# EAGLE design pov (EAGLE 6.1)
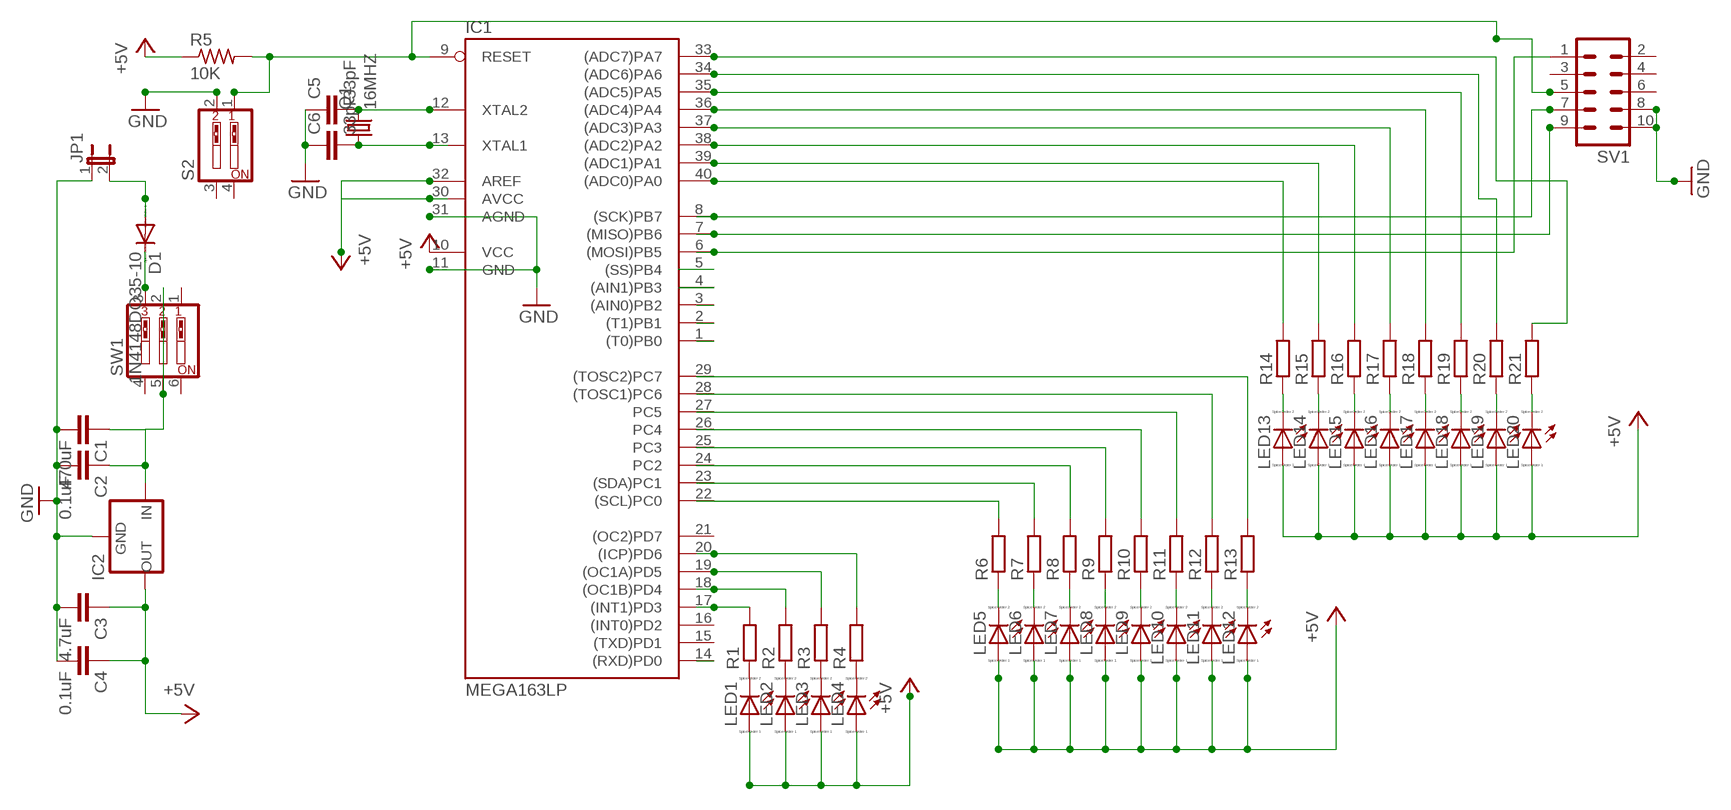
[diagram p0: schematic, sheet 1]

## Parts
C1  470uF  C2.5/4  [C2.5-4]
C2  0.1uF  C2.5/4  [C2.5-4]
C3  4.7uF  C2.5/4  [C2.5-4]
C4  0.1uF  C2.5/4  [C2.5-4]
C5  33pF  C2.5/4  [C2.5-4]
C6  33pF  C2.5/4  [C2.5-4]
D1  1N4148DO35-10  [DO35-10]
IC1  MEGA163LP  [DIL40]
IC2  78XXS  [78XXS]
JP1  JP1E  [JP1]
LED1  LED_ELD260  [LED_LD260]
LED2  LED_ELD260  [LED_LD260]
LED3  LED_ELD260  [LED_LD260]
LED4  LED_ELD260  [LED_LD260]
LED5  LED_ELD260  [LED_LD260]
LED6  LED_ELD260  [LED_LD260]
LED7  LED_ELD260  [LED_LD260]
LED8  LED_ELD260  [LED_LD260]
LED9  LED_ELD260  [LED_LD260]
LED10  LED_ELD260  [LED_LD260]
LED11  LED_ELD260  [LED_LD260]
LED12  LED_ELD260  [LED_LD260]
LED13  LED_ELD260  [LED_LD260]
LED14  LED_ELD260  [LED_LD260]
LED15  LED_ELD260  [LED_LD260]
LED16  LED_ELD260  [LED_LD260]
LED17  LED_ELD260  [LED_LD260]
LED18  LED_ELD260  [LED_LD260]
LED19  LED_ELD260  [LED_LD260]
LED20  LED_ELD260  [LED_LD260]
Q1  16MHZ  CRYSTALHC49U-V  [HC49U-V]
R1  R-EU_0207/7  [0207/7]
R2  R-EU_0207/7  [0207/7]
R3  R-EU_0207/7  [0207/7]
R4  R-EU_0207/7  [0207/7]
R5  10K  R-US_0204/7  [0204/7]
R6  R-EU_0207/7  [0207/7]
R7  R-EU_0207/7  [0207/7]
R8  R-EU_0207/7  [0207/7]
R9  R-EU_0207/7  [0207/7]
R10  R-EU_0207/7  [0207/7]
R11  R-EU_0207/7  [0207/7]
R12  R-EU_0207/7  [0207/7]
R13  R-EU_0207/7  [0207/7]
R14  R-EU_0207/7  [0207/7]
R15  R-EU_0207/7  [0207/7]
R16  R-EU_0207/7  [0207/7]
R17  R-EU_0207/7  [0207/7]
R18  R-EU_0207/7  [0207/7]
R19  R-EU_0207/7  [0207/7]
R20  R-EU_0207/7  [0207/7]
R21  R-EU_0207/7  [0207/7]
S2  SW_DIP-2  [EDG-02]
SV1  MA05-2  [MA05-2]
SW1  SW_DIP-3  [EDG-03]

## Nets
+5V: C3.1 C4.1 IC1.10(VCC) IC1.30(AVCC) IC1.32(AREF) IC2.OUT LED1.A LED2.A LED3.A LED4.A LED5.A LED6.A LED7.A LED8.A LED9.A LED10.A LED11.A LED12.A LED13.A LED14.A LED15.A LED16.A LED17.A LED18.A LED19.A LED20.A R5.1
GND: C1.2 C2.2 C3.2 C4.2 C5.1 C6.1 IC1.11(GND) IC1.31(AGND) IC2.GND JP1.1 S2.2 SV1.8 SV1.10
N$1: D1.A JP1.2
N$2: LED12.K(C) R13.1
N$3: C5.2 IC1.12(XTAL2) Q1.2
N$4: C6.2 IC1.13(XTAL1) Q1.1
N$5: LED1.K(C) R1.1
N$6: IC1.9(RESET) R5.2 S2.1 SV1.5
N$7: IC1.22((SCL)PC0) R6.2
N$8: D1.C SW1.3
N$9: C1.1 C2.1 IC2.IN SW1.2 SW1.5
N$10: IC1.1((T0)PB0)
N$11: IC1.2((T1)PB1)
N$12: IC1.3((AIN0)PB2)
N$13: IC1.4((AIN1)PB3)
N$14: IC1.17((INT1)PD3) R1.2
N$15: IC1.19((OC1A)PD5) R3.2
N$16: IC1.5((SS)PB4)
N$17: IC1.28((TOSC1)PC6) R12.2
N$18: LED10.K(C) R11.1
N$19: IC1.26(PC4) R10.2
N$20: LED9.K(C) R10.1
N$21: IC1.25(PC3) R9.2
N$22: LED8.K(C) R9.1
N$23: LED7.K(C) R8.1
N$24: IC1.6((MOSI)PB5) SV1.1
N$25: IC1.7((MISO)PB6) SV1.9
N$26: IC1.8((SCK)PB7) SV1.7
N$27: IC1.14((RXD)PD0)
N$28: IC1.23((SDA)PC1) R7.2
N$29: IC1.33((ADC7)PA7) R21.2
N$30: IC1.34((ADC6)PA6) R20.2
N$31: IC1.35((ADC5)PA5) R19.2
N$32: IC1.36((ADC4)PA4) R18.2
N$33: IC1.37((ADC3)PA3) R17.2
N$34: IC1.38((ADC2)PA2) R16.2
N$35: IC1.39((ADC1)PA1) R15.2
N$36: IC1.40((ADC0)PA0) R14.2
N$37: IC1.24(PC2) R8.2
N$38: IC1.27(PC5) R11.2
N$39: IC1.29((TOSC2)PC7) R13.2
N$40: LED6.K(C) R7.1
N$41: LED20.K(C) R21.1
N$42: LED19.K(C) R20.1
N$43: LED18.K(C) R19.1
N$44: LED17.K(C) R18.1
N$45: LED15.K(C) R16.1
N$46: LED13.K(C) R14.1
N$47: LED16.K(C) R17.1
N$48: LED14.K(C) R15.1
N$49: LED5.K(C) R6.1
N$50: LED11.K(C) R12.1
N$51: LED2.K(C) R2.1
N$52: LED3.K(C) R3.1
N$53: LED4.K(C) R4.1
N$55: IC1.20((ICP)PD6) R4.2
N$56: IC1.18((OC1B)PD4) R2.2
Unconnected: IC1.15((TXD)PD1) IC1.16((INT0)PD2) IC1.21((OC2)PD7) S2.3 S2.4 SV1.2 SV1.3 SV1.4 SV1.6 SW1.1 SW1.4 SW1.6

## Library data of the parts
C1-C6 = capacitor-wima:C: CAPACITOR naming: grid - package width
D1 = diode:1N4148: DIODE high speed (Philips)
IC1 = atmel:MEGA163*P: MICROCONTROLLER 16 Kbytes FLASH 1 Kbytes EEPROM 1 Kbytes SRAM UART 8-channel 10 bit ADC hardware multiplier Source: avr.lbr; OC_FARNELL: unknown; OC_NEWARK: unknown
IC2 = v-reg:78XXS: VOLTAGE REGULATOR
JP1 = jumper:JP1E: JUMPER
LED1-LED20 = eagle-ltspice:LED_E: LED Source: http://www.osram.convergy.de Source: www.luxeon.com Source: www.kingbright.com; SPICEMODEL: NONE; SPICEPREFIX: D; SPICETYPE: diode
Q1 = crystal:CRYSTAL: CRYSTAL; OC_FARNELL: 1666969; OC_NEWARK: unknown
R1-R4 R6-R21 = rcl:R-EU_: RESISTOR, European symbol
R5 = resistor:R-US_: RESISTOR, American symbol
S2 = special:SW_DIP-2: DIP SWITCH
SV1 = con-lstb:MA05-2: PIN HEADER; OC_FARNELL: unknown; OC_NEWARK: unknown
SW1 = special:SW_DIP-3: DIP SWITCH

## Board
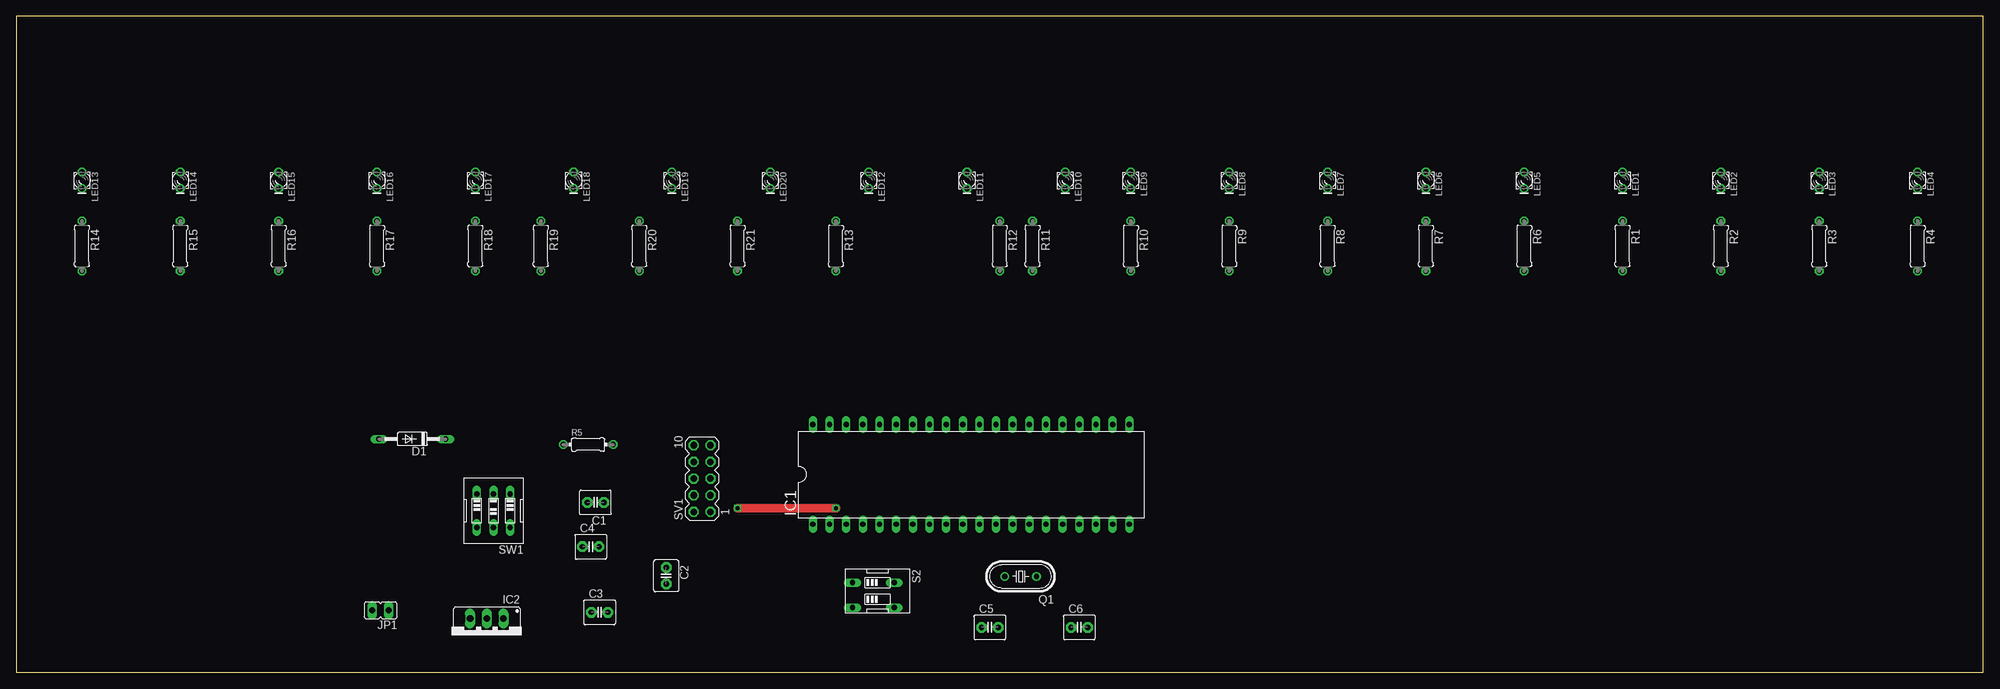
[diagram p1: board, top side]
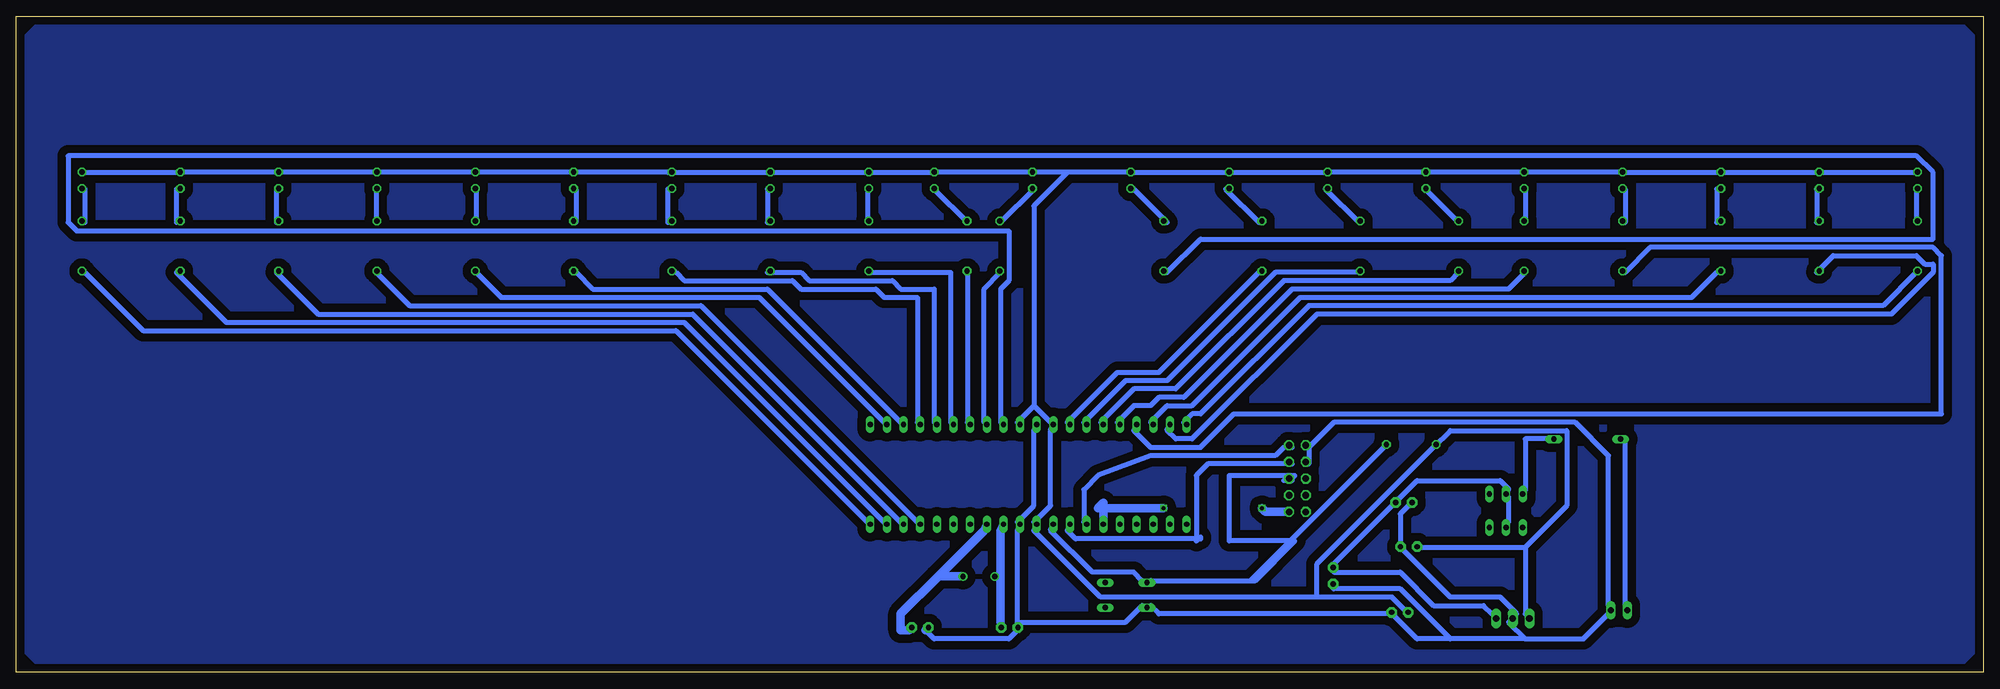
[diagram p2: board, bottom side, seen from below]

Size 300 x 100 mm. Coordinates in mm from the lower left corner, seen from the top.
Outline: 0,0 300,0 300,100 0,100 0,0
Copper layers (1*16): Top 0.035mm / dielectric 1.5mm / Bottom 0.035mm
Design rules: minimum track width 30mil, minimum drill 24mil, track to track 8mil, track to pad 8mil, pad to pad 8mil, via to via 8mil, smd to smd 8mil, copper to edge 40mil, drill to drill 8mil, minimum pad ring 10mil, minimum via ring 8mil, stop-mask expansion 4mil, vias tented up to drill 0mil, thermal gap 10mil

### Footprints (pad centres in the part's own frame; a part is rotated, then mirrored left to right if it is on the bottom)
C2.5-4 = drill 0.813 pad 1.6 octagon: 1 -1.27,0; 2 1.27,0
DO35-10 = drill 0.813 long: A 5.08,0; C -5.08,0
DIL40 = drill 0.813 long: 1 -24.13,-7.62; 2 -21.59,-7.62; 3 -19.05,-7.62; 4 -16.51,-7.62; 5 -13.97,-7.62; 6 -11.43,-7.62; 7 -8.89,-7.62; 8 -6.35,-7.62; 9 -3.81,-7.62; 10 -1.27,-7.62; 11 1.27,-7.62; 12 3.81,-7.62; 13 6.35,-7.62; 14 8.89,-7.62; 15 11.43,-7.62; 16 13.97,-7.62; 17 16.51,-7.62; 18 19.05,-7.62; 19 21.59,-7.62; 20 24.13,-7.62; 21 24.13,7.62; 22 21.59,7.62; 23 19.05,7.62; 24 16.51,7.62; 25 13.97,7.62; 26 11.43,7.62; 27 8.89,7.62; 28 6.35,7.62; 29 3.81,7.62; 30 1.27,7.62; 31 -1.27,7.62; 32 -3.81,7.62; 33 -6.35,7.62; 34 -8.89,7.62; 35 -11.43,7.62; 36 -13.97,7.62; 37 -16.51,7.62; 38 -19.05,7.62; 39 -21.59,7.62; 40 -24.13,7.62
78XXS = drill 1.016 long: GND 0,-2.54; IN -2.54,-2.54; OUT 2.54,-2.54
JP1 = drill 0.914 long: 1 0,-1.27; 2 0,1.27
LED_LD260 = drill 0.813 octagon: A -1.27,0; K 1.27,0
HC49U-V = drill 0.813: 1 -2.413,0; 2 2.413,0
0207/7 = drill 0.813 octagon: 1 -3.81,0; 2 3.81,0
0204/7 = drill 0.813 octagon: 1 -3.81,0; 2 3.81,0
EDG-02 = drill 0.813 long: 1 -1.27,-3.81; 2 2.54,-3.81; 3 2.54,2.54; 4 -1.27,2.54
MA05-2 = drill 1.016 octagon: 1 -5.08,-1.27; 2 -5.08,1.27; 3 -2.54,-1.27; 4 -2.54,1.27; 5 0,-1.27; 6 0,1.27; 7 2.54,-1.27; 8 2.54,1.27; 9 5.08,-1.27; 10 5.08,1.27
EDG-03 = drill 0.813 long: 1 -2.54,-2.54; 2 0,-2.54; 3 2.54,-2.54; 4 2.54,2.54; 5 0,2.54; 6 -2.54,2.54

### Placement (x,y rotation side)
C1  88.34,25.87 180 top
C2  99.13,14.69 270 top
C3  88.96,9.13 0 top
C4  87.61,19.13 0 top
C5  148.49,6.83 0 top
C6  162.14,6.83 0 top
D1  60.4,35.55 180 top
IC1  145.63,30.16 0 top
IC2  71.75,5.63 180 top
JP1  55.55,9.44 90 top
LED1  245,75 270 top
LED2  260,75 270 top
LED3  275,75 270 top
LED4  290,75 270 top
LED5  230,75 270 top
LED6  215,75 270 top
LED7  200,75 270 top
LED8  185,75 270 top
LED9  170,75 270 top
LED10  160,75 270 top
LED11  145,75 270 top
LED12  130,75 270 top
LED13  10,75 270 top
LED14  25,75 270 top
LED15  40,75 270 top
LED16  55,75 270 top
LED17  70,75 270 top
LED18  85,75 270 top
LED19  100,75 270 top
LED20  115,75 270 top
Q1  153.18,14.6 180 top
R1  245,65 270 top
R2  260,65 270 top
R3  275,65 270 top
R4  290,65 270 top
R5  87.22,34.69 0 top
R6  230,65 270 top
R7  215,65 270 top
R8  200,65 270 top
R9  185,65 270 top
R10  170,65 270 top
R11  155,65 270 top
R12  150,65 270 top
R13  125,65 270 top
R14  10,65 270 top
R15  25,65 270 top
R16  40,65 270 top
R17  55,65 270 top
R18  70,65 270 top
R19  80,65 270 top
R20  95,65 270 top
R21  110,65 270 top
S2  131.35,12.39 270 top
SV1  104.6,29.52 90 top
SW1  72.78,24.6 180 top

### Tracks (layer width: path | path; a pad name or v marks a point on that pad's centre or on a via)
+5V
  Bottom 0.762: 69.85,19.05 69.85,8.89 IC2.OUT | 69.85,19.05 86.36,19.05 C4.1 | 144.78,40.64 147.32,38.1 IC1.30 | 144.78,40.64 142.24,38.1 IC1.32 142.24,36.83 142.24,25.4 144.78,22.86 IC1.10 144.78,21.59 134.62,11.43 101.6,11.43 | 83.82,34.29 101.6,16.51 101.6,11.43 | 101.6,11.43 90.17,11.43 87.63,8.89 C3.1 | 69.85,19.05 63.5,25.4 63.5,36.83 81.28,36.83 83.82,34.29 | 83.82,34.29 R5.1 | 25.4,76.2 10.16,76.2 LED13.A | 54.61,76.2 40.64,76.2 LED15.A 39.37,76.2 25.4,76.2 | 54.61,76.2 69.85,76.2 | 54.61,76.2 LED16.A | 69.85,76.2 85.09,76.2 | 69.85,76.2 LED17.A | 85.09,76.2 100.33,76.2 | 85.09,76.2 LED18.A | 25.4,76.2 LED14.A | 170.18,76.2 160.02,76.2 | 129.54,76.2 115.57,76.2 | 129.54,76.2 139.7,76.2 | 139.7,76.2 144.78,76.2 | 129.54,76.2 LED12.A | 144.78,76.2 160.02,76.2 | 160.02,76.2 LED10.A | 144.78,76.2 LED11.A | 275.59,76.2 289.56,76.2 LED4.A | 185.42,76.2 199.39,76.2 LED7.A 200.66,76.2 214.63,76.2 | 214.63,76.2 229.87,76.2 | 214.63,76.2 LED6.A | 229.87,76.2 245.11,76.2 | 229.87,76.2 LED5.A | 245.11,76.2 260.35,76.2 | 245.11,76.2 LED1.A | 260.35,76.2 275.59,76.2 | 275.59,76.2 LED3.A | 260.35,76.2 LED2.A | 185.42,76.2 170.18,76.2 | 170.18,76.2 LED9.A | 185.42,76.2 LED8.A | 115.57,76.2 100.33,76.2 | 100.33,76.2 LED19.A | 115.57,76.2 LED20.A | 144.78,40.64 144.78,71.12 139.7,76.2
GND
  Bottom 0.762: 147.32,7.62 130.81,7.62 128.27,10.16 S2.2 127,10.16 125.73,8.89 90.17,8.89 | 147.32,7.62 147.32,21.59 IC1.11 147.32,22.86 144.78,25.4 144.78,36.83 IC1.31 | 147.32,7.62 C5.1 147.32,6.35 148.59,5.08 160.02,5.08 161.29,6.35 | 88.9,19.05 88.9,24.13 87.63,25.4 C1.2 | 102.87,34.29 102.87,31.75 SV1.8 | 69.85,5.08 60.96,5.08 57.15,8.89 JP1.1 57.15,10.16 57.15,33.02 62.23,38.1 99.06,38.1 102.87,34.29 | 69.85,5.08 72.39,7.62 IC2.GND 71.12,8.89 73.66,11.43 81.28,11.43 88.9,19.05 | 90.17,8.89 86.36,5.08 81.28,5.08 | 69.85,5.08 81.28,5.08 | 81.28,5.08 88.9,12.7 99.06,12.7 C2.2 | 102.87,34.29 SV1.10 | 88.9,19.05 C4.2 | 90.17,8.89 C3.2
  Bottom 1.27: 161.29,6.35 C6.1
N$1
  Bottom 0.762: D1.A 54.61,35.56 54.61,10.16 JP1.2
N$2
  Bottom 0.762: R13.1 124.46,68.58 129.54,73.66 LED12.K
N$3
  Bottom 0.406: 150.26,14.6 149.86,15
  Bottom 0.762: 149.86,7.62 C5.2
  Bottom 1.27: 149.86,7.62 149.86,15 149.86,21.59 IC1.12 | Q1.2 150.26,14.6
N$4
  Bottom 0.406: 159.39,14.6 159.5,14.49
  Bottom 1.27: IC1.13 152.4,21.59 159.5,14.49 165.1,8.89 165.1,6.35 163.83,6.35 C6.2 | Q1.1 159.39,14.6
N$5
  Bottom 0.762: R1.1 245.11,68.58 245.11,73.66 LED1.K
N$6
  Bottom 0.762: 111.76,13.97 91.44,34.29 R5.2 | 111.76,13.97 127,13.97 S2.1 128.27,13.97 129.54,15.24 135.89,15.24 142.24,21.59 IC1.9 | 105.79,29.21 105.41,29.21 SV1.5 | 111.76,13.97 111.03,13.97 105,20 115,20 115,30 105,30 105.79,29.21 | 105.79,29.21 106.68,29.21
N$7
  Bottom 0.762: IC1.22 167.64,38.1 186.69,57.15 226.06,57.15 229.87,60.96 R6.2
N$8
  Bottom 0.762: SW1.3 69.85,27.94 69.85,35.56 66.04,35.56 D1.C
N$9
  Bottom 0.762: SW1.5 72.39,22.86 72.39,26.67 SW1.2 72.39,27.94 73.66,29.21 86.36,29.21 90.17,25.4 | IC2.IN 74.93,8.89 76.2,10.16 83.82,10.16 88.9,15.24 99.06,15.24 C2.1 99.06,16.51 90.17,25.4 | 90.17,25.4 C1.1
N$14
  Bottom 0.762: IC1.17 162.56,22.86 195.58,55.88 240.03,55.88 245.11,60.96 R1.2
N$15
  Bottom 0.762: IC1.19 167.64,22.86 198.12,53.34 267.97,53.34 275.59,60.96 R3.2
N$17
  Bottom 0.762: R12.2 149.86,60.96 152.4,58.42 152.4,38.1 IC1.28
N$18
  Bottom 0.762: R11.1 154.94,68.58 160.02,73.66 LED10.K
N$19
  Bottom 0.762: IC1.26 157.48,38.1 157.48,60.96 170.18,60.96 R10.2
N$20
  Bottom 0.762: R10.1 170.18,68.58 170.18,73.66 LED9.K
N$21
  Bottom 0.762: IC1.25 160.02,38.1 160.02,58.42 165.1,58.42 166.37,59.69 179.07,59.69 180.34,60.96 185.42,60.96 R9.2
N$22
  Bottom 0.762: R9.1 185.42,68.58 185.42,73.66 LED8.K
N$23
  Bottom 0.762: R8.1 200.66,68.58 200.66,73.66 LED7.K
N$24  (via drill 0.6)
  Top 1.27: v125,25 v110,25
  Bottom 1.27: IC1.6 134.2,25.8 135,25 v125,25 | SV1.1 109.44,24.44 v110,25
N$25
  Bottom 0.762: IC1.7 137.16,22.86 137.16,27.84 135,30 127,33.02 107.95,33.02 106.68,34.29 105.41,34.29 SV1.9
N$26
  Bottom 0.762: 120,20 120,30 118.25,31.75 105.41,31.75 SV1.7 | 120,20 119.38,20.62 120,20 | 120,20 119.68,20.32 119.38,20.32 138.43,20.32 139.7,21.59 IC1.8
N$28
  Bottom 0.762: IC1.23 165.1,38.1 185.42,58.42 212.09,58.42 214.63,60.96 R7.2
N$29
  Bottom 0.762: R21.2 110.49,60.96 125.73,45.72 132.08,45.72 139.7,38.1 IC1.33
N$30
  Bottom 0.762: IC1.34 137.16,38.1 130.81,44.45 124.46,44.45 107.95,60.96 95.25,60.96 R20.2
N$31
  Bottom 0.762: IC1.35 134.62,38.1 129.54,43.18 123.19,43.18 106.68,59.69 81.28,59.69 80.01,60.96 R19.2
N$32
  Bottom 0.762: IC1.36 132.08,38.1 129.54,40.64 127,40.64 125.73,41.91 121.92,41.91 105.41,58.42 72.39,58.42 69.85,60.96 R18.2
N$33
  Bottom 0.762: R17.2 54.61,60.96 50.8,64.77 7.62,64.77 6.35,63.5 6.35,39.37 114.3,39.37 119.38,34.29 127,34.29 129.54,36.83 IC1.37
N$34
  Bottom 0.762: R16.2 40.64,60.96 44.45,57.15 104.14,57.15 120.65,40.64 124.46,40.64 127,38.1 IC1.38
N$35
  Bottom 0.762: IC1.39 124.46,36.83 123.19,35.56 120.65,35.56 101.6,54.61 13.97,54.61 7.62,60.96 7.62,62.23 8.89,62.23 10.16,63.5 22.86,63.5 25.4,60.96 R15.2
N$36
  Bottom 0.762: IC1.40 121.92,38.1 120.65,39.37 119.38,39.37 102.87,55.88 15.24,55.88 10.16,60.96 R14.2
N$37
  Bottom 0.762: IC1.24 162.56,38.1 162.56,57.15 167.64,57.15 168.91,58.42 180.34,58.42 181.61,59.69 198.12,59.69 199.39,60.96 R8.2
N$38
  Bottom 0.762: IC1.27 154.94,38.1 154.94,60.96 R11.2
N$39
  Bottom 0.762: IC1.29 149.86,38.1 149.86,58.42 148.59,59.69 148.59,67.31 290.83,67.31 292.1,68.58 292.1,78.74 10.16,78.74 7.62,76.2 7.62,66.04 119.38,66.04 124.46,60.96 R13.2
N$40
  Bottom 0.762: R7.1 214.63,68.58 214.63,73.66 LED6.K
N$41
  Bottom 0.762: R21.1 110.49,68.58 115.57,73.66 LED20.K
N$42
  Bottom 0.762: R20.1 95.25,68.58 100.33,73.66 LED19.K
N$43
  Bottom 0.762: R19.1 80.01,68.58 85.09,73.66 LED18.K
N$44
  Bottom 0.762: R18.1 69.85,68.58 69.85,73.66 LED17.K
N$45
  Bottom 0.762: R16.1 40.64,68.58 40.64,73.66 LED15.K
N$46
  Bottom 0.762: R14.1 10.16,68.58 10.16,73.66 LED13.K
N$47
  Bottom 0.762: R17.1 54.61,68.58 54.61,73.66 LED16.K
N$48
  Bottom 0.762: R15.1 25.4,68.58 25.4,73.66 LED14.K
N$49
  Bottom 0.762: R6.1 229.87,68.58 229.87,73.66 LED5.K
N$50
  Bottom 0.762: R12.1 149.86,68.58 144.78,73.66 LED11.K
N$51
  Bottom 0.762: R2.1 260.35,68.58 260.35,73.66 LED2.K
N$52
  Bottom 0.762: R3.1 275.59,68.58 275.59,73.66 LED3.K
N$53
  Bottom 0.762: R4.1 289.56,68.58 289.56,73.66 LED4.K
N$54
  pour Bottom (isolate 1.27): 5,0 0,5 0,95 5,100 295,100 300,95 300,5 295,0
N$55
  Bottom 0.762: IC1.20 170.18,22.86 199.39,52.07 280.67,52.07 289.56,60.96 R4.2
N$56
  Bottom 0.762: IC1.18 165.1,22.86 196.85,54.61 254,54.61 260.35,60.96 R2.2